# EAGLE design untitled (EAGLE 9.1.0)

## Sheet 1 of 2: voltage part
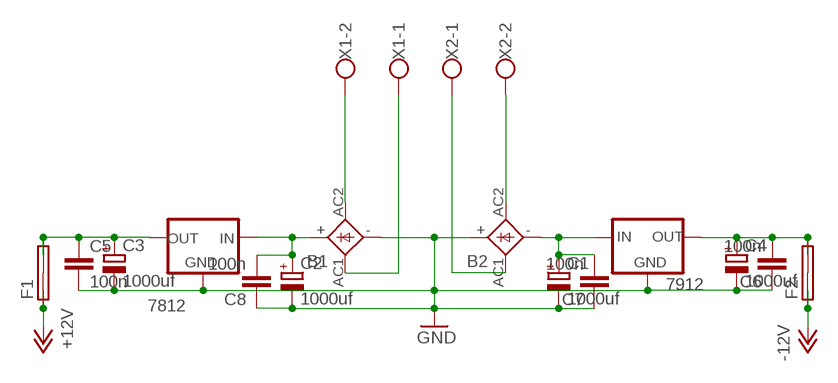
[diagram p0: schematic, sheet 1]

### Parts
7812  79XXS  [79XXS]
7912  78XXS  [78XXS]
B1  FB15  [FB15]
B2  FB15  [FB15]
C1  1000uf  CPOL-EUTT5D11  [TT5D11]
C2  1000uf  CPOL-EUTT5D11  [TT5D11]
C3  1000uf  CPOL-EUTT5D11  [TT5D11]
C4  1000uf  CPOL-EUTT5D11  [TT5D11]
C5  100n  C-EU075-032X103  [C075-032X103]
C6  100n  C-EU075-032X103  [C075-032X103]
C7  100n  C-EU075-032X103  [C075-032X103]
C8  100n  C-EU075-032X103  [C075-032X103]
F1  SHK20L  [SHK20L]
F2  SHK20L  [SHK20L]
X1  W237-102  [W237-102]
X2  W237-102  [W237-102]

### Nets
+12V: F1.1A F1.1B ; also sheet 2
-12V: F2.1A F2.1B ; also sheet 2
GND: 7812.GND 7912.GND B1.- B2.+ C1.- C2.- C3.- C4.- C5.2 C6.1 C7.1 C8.1 ; also sheet 2
N$1: 7912.IN B2.- C1.+ C7.2
N$3: 7812.IN B1.+ C2.+ C8.2
N$5: 7912.OUT C4.+ C6.2 F2.2A F2.2B
N$6: 7812.OUT C3.+ C5.1 F1.2A F1.2B
N$7: B1.AC2 X1.2
N$8: B2.AC2 X2.2
N$9: B1.AC1 X1.1
N$10: B2.AC1 X2.1

## Sheet 2 of 2: bus part
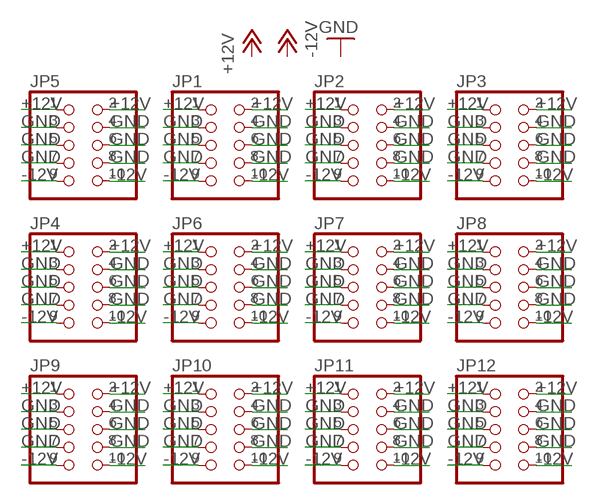
[diagram p1: schematic, sheet 2]

### Parts
JP1  PINHD-2X5  [2X05]
JP2  PINHD-2X5  [2X05]
JP3  PINHD-2X5  [2X05]
JP4  PINHD-2X5  [2X05]
JP5  PINHD-2X5  [2X05]
JP6  PINHD-2X5  [2X05]
JP7  PINHD-2X5  [2X05]
JP8  PINHD-2X5  [2X05]
JP9  PINHD-2X5  [2X05]
JP10  PINHD-2X5  [2X05]
JP11  PINHD-2X5  [2X05]
JP12  PINHD-2X5  [2X05]

### Nets
+12V: JP1.1 JP1.2 JP2.1 JP2.2 JP3.1 JP3.2 JP4.1 JP4.2 JP5.1 JP5.2 JP6.1 JP6.2 JP7.1 JP7.2 JP8.1 JP8.2 JP9.1 JP9.2 JP10.1 JP10.2 JP11.1 JP11.2 JP12.1 JP12.2 ; also sheet 1
-12V: JP1.9 JP1.10 JP2.9 JP2.10 JP3.9 JP3.10 JP4.9 JP4.10 JP5.9 JP5.10 JP6.9 JP6.10 JP7.9 JP7.10 JP8.9 JP8.10 JP9.9 JP9.10 JP10.9 JP10.10 JP11.9 JP11.10 JP12.9 JP12.10 ; also sheet 1
GND: JP1.3 JP1.4 JP1.5 JP1.6 JP1.7 JP1.8 JP2.3 JP2.4 JP2.5 JP2.6 JP2.7 JP2.8 JP3.3 JP3.4 JP3.5 JP3.6 JP3.7 JP3.8 JP4.3 JP4.4 JP4.5 JP4.6 JP4.7 JP4.8 JP5.3 JP5.4 JP5.5 JP5.6 JP5.7 JP5.8 JP6.3 JP6.4 JP6.5 JP6.6 JP6.7 JP6.8 JP7.3 JP7.4 JP7.5 JP7.6 JP7.7 JP7.8 JP8.3 JP8.4 JP8.5 JP8.6 JP8.7 JP8.8 JP9.3 JP9.4 JP9.5 JP9.6 JP9.7 JP9.8 JP10.3 JP10.4 JP10.5 JP10.6 JP10.7 JP10.8 JP11.3 JP11.4 JP11.5 JP11.6 JP11.7 JP11.8 JP12.3 JP12.4 JP12.5 JP12.6 JP12.7 JP12.8 ; also sheet 1

## Library data of the parts
7812 = v-reg:79XXS: VOLTAGE REGULATOR
7912 = v-reg:78XXS: VOLTAGE REGULATOR
B1 B2 = rectifier:FB15: FAGOR RECTIFIER grid 3 x 5 mm
C1-C4 = resistor:CPOL-EU: POLARIZED CAPACITOR, European symbol
C5-C8 = resistor:C-EU: CAPACITOR, European symbol
F1 F2 = fuse:SHK20L: FUSE HOLDER 5 x 20 mm, SH contact, SHH1 Schukat, E1073 Buerklin; OC_FARNELL: unknown; OC_NEWARK: unknown
JP1-JP12 = pinhead:PINHD-2X5: PIN HEADER
X1 X2 = con-wago-500:W237-102: WAGO SCREW CLAMP; MPN: 237-102; OC_FARNELL: unknown; OC_NEWARK: 70K9898

## Net classes
0 default: width 1.27 mm

## Board
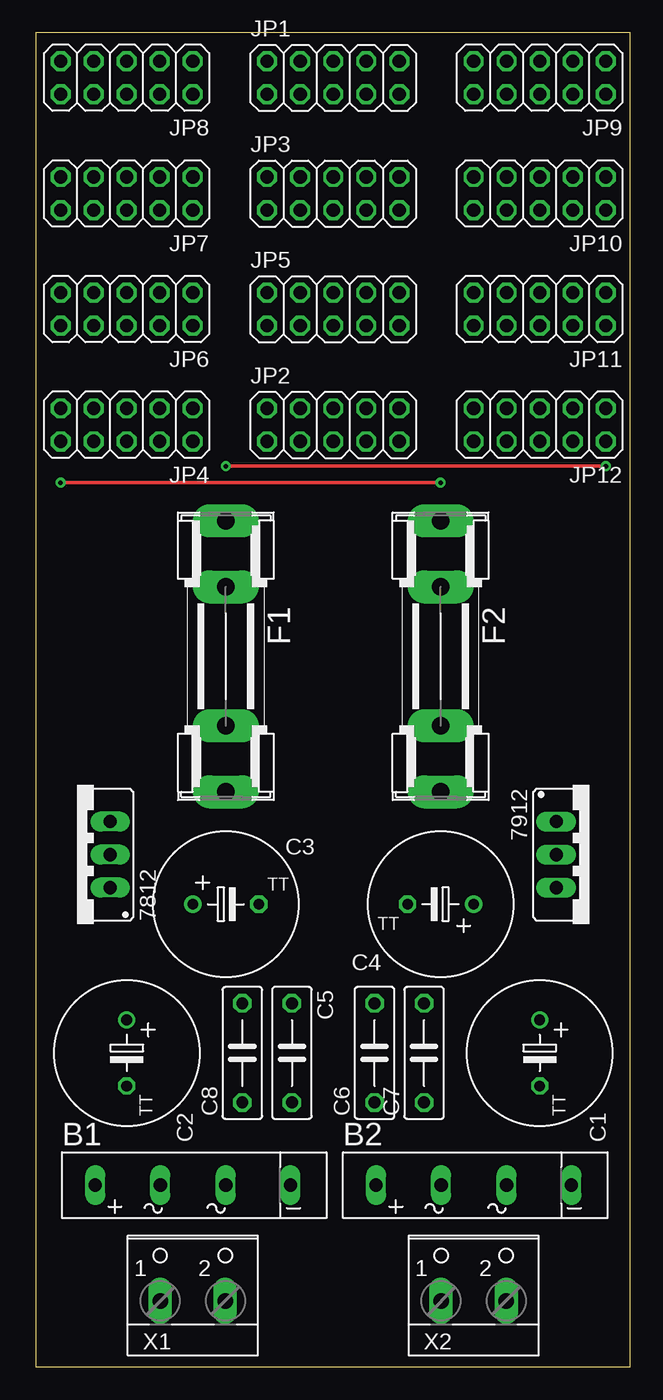
[diagram p2: board, top side]
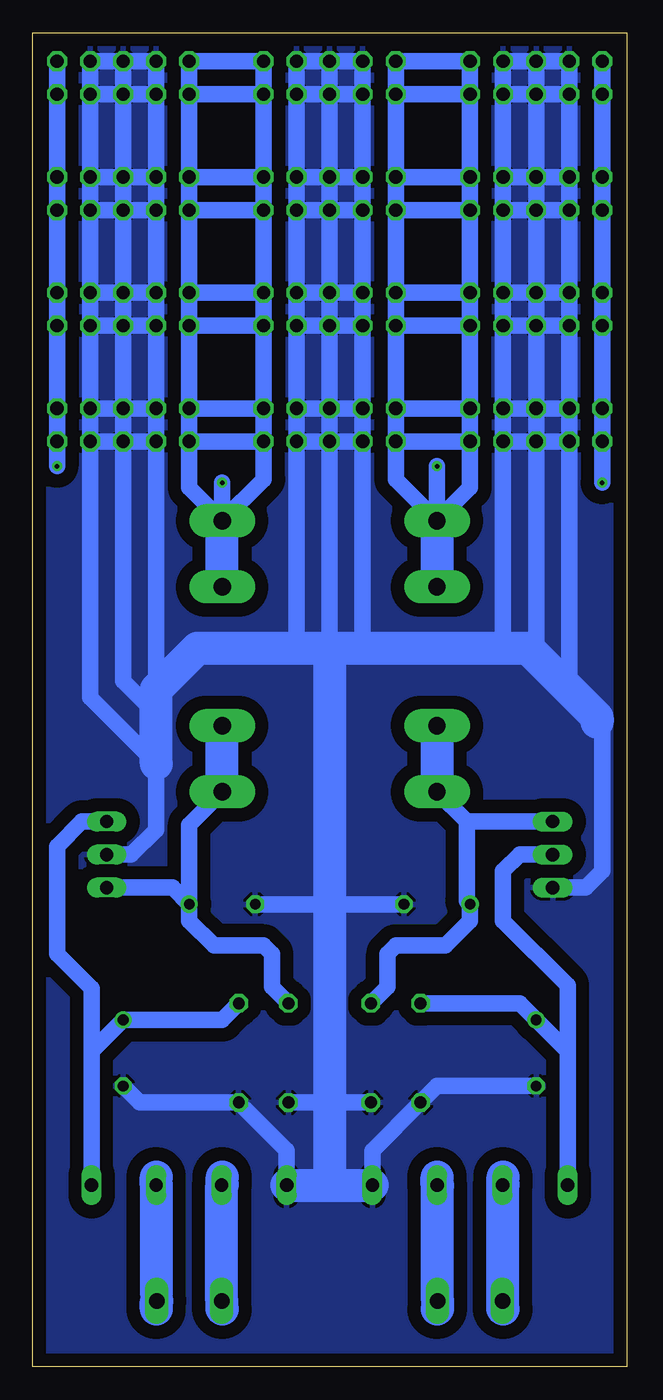
[diagram p3: board, bottom side, seen from below]

Size 45.7 x 102.54 mm. Coordinates in mm from the lower left corner, seen from the top.
Outline: 0,0 45.7,0 45.7,102.54 0,102.54 0,0
Copper layers (1*16): Top 0.035mm / dielectric 1.5mm / Bottom 0.035mm
Design rules "default": minimum track width 6mil, minimum drill 0.35mm, track to track 6mil, track to pad 6mil, pad to pad 6mil, via to via 6mil, smd to smd 6mil, copper to edge 40mil, drill to drill 6mil, minimum pad ring 10mil, minimum via ring 8mil, stop-mask expansion 4mil, vias tented up to drill 0mil, thermal gap 10mil

### Footprints (pad centres in the part's own frame; a part is rotated, then mirrored left to right if it is on the bottom)
79XXS = drill 1.016 long: GND -2.54,-2.54; IN 0,-2.54; OUT 2.54,-2.54
78XXS = drill 1.016 long: GND 0,-2.54; IN -2.54,-2.54; OUT 2.54,-2.54
FB15 = drill 1.016 long: + -7.5,0; - 7.511,0; AC1 -2.496,0; AC2 2.533,0
TT5D11 = drill 0.813: + -2.54,0 | drill 0.813 octagon: - 2.54,0
C075-032X103 = drill 0.914 octagon: 1 -3.81,0; 2 3.81,0
SHK20L = drill 1.321 pad 2.54 long: 1A -10.414,0; 1B -5.334,0; 2A 10.414,0; 2B 5.334,0
2X05 = drill 1.016 octagon: 1 -5.08,-1.27; 2 -5.08,1.27; 3 -2.54,-1.27; 4 -2.54,1.27; 5 0,-1.27; 6 0,1.27; 7 2.54,-1.27; 8 2.54,1.27; 9 5.08,-1.27; 10 5.08,1.27
W237-102 = drill 1.194 long: 1 -2.5,-1.27; 2 2.5,-1.27

### Placement (x,y rotation side)
7812  3.17,39.37 90 top
7912  42.55,39.37 270 top
B1  12.07,13.97 0 top
B2  33.66,13.97 0 top
C1  38.73,24.13 270 top
C2  6.98,24.13 270 top
C3  14.61,35.56 0 top
C4  31.12,35.56 180 top
C5  19.68,24.13 270 top
C6  26.04,24.13 90 top
C7  29.84,24.13 90 top
C8  15.88,24.13 90 top
F1  14.61,54.61 270 top
F2  31.12,54.61 270 top
JP1  22.86,99.06 0 top
JP2  22.86,72.39 0 top
JP3  22.86,90.17 0 top
JP4  6.98,72.39 180 top
JP5  22.86,81.28 0 top
JP6  6.98,81.28 180 top
JP7  6.98,90.17 180 top
JP8  6.98,99.06 180 top
JP9  38.73,99.06 180 top
JP10  38.73,90.17 180 top
JP11  38.73,81.28 180 top
JP12  38.73,72.39 180 top
X1  12.07,6.35 0 top
X2  33.66,6.35 0 top

### Tracks (layer width: path | path; a pad name or v marks a point on that pad's centre or on a via)
+12V  (via drill 0.35)
  Top 0.254: v43.81,69.22 v14.61,69.22
  Bottom 1.27: F1.1A 17.78,68.2 JP2.1 | JP2.1 JP2.2 | JP2.2 JP5.1 | JP5.1 JP5.2 | JP5.2 JP3.1 | JP3.1 JP3.2 | JP3.2 JP1.1 | JP1.1 JP1.2 JP8.1 JP8.2 | JP7.1 JP7.2 | JP6.1 JP6.2 JP5.1 | JP4.1 JP4.2 | JP2.1 JP4.2 | JP3.1 JP7.2 | JP1.1 JP8.2 | JP9.2 JP9.1 JP10.2 JP10.1 JP11.2 JP11.1 JP12.2 | JP12.2 JP12.1 | JP4.1 JP2.2 | JP4.1 JP6.1 | JP6.1 JP5.2 | JP6.1 JP7.2 | JP7.1 JP3.2 | JP7.1 JP8.2 | JP4.2 12.07,67.56 F1.1A | JP12.2 v43.81,69.22 | v14.61,69.22 F1.1A
  Bottom 2.54: F1.1A F1.1B
-12V  (via drill 0.35)
  Top 0.254: v1.9,67.94 v31.12,67.94
  Bottom 1.27: JP1.9 JP1.10 JP9.9 | JP1.9 JP3.10 | JP3.10 JP3.9 | JP3.9 JP5.10 | JP5.10 JP5.9 | JP5.9 JP2.10 | JP2.10 JP2.9 | F2.1A 27.94,68.2 JP2.9 | JP8.9 JP8.10 JP7.9 JP7.10 JP6.9 JP6.10 JP4.9 JP4.10 v1.9,67.94 | JP9.9 JP9.10 JP1.9 | JP11.9 JP12.9 | JP12.9 JP12.10 | JP11.9 JP11.10 JP5.9 | JP11.9 JP10.9 | JP10.9 JP10.10 JP3.9 | JP10.9 JP9.9 | JP12.10 33.66,67.56 F2.1A | JP12.10 JP2.9 | JP2.10 JP12.9 | JP5.10 JP11.9 | JP3.10 JP10.9 | v31.12,67.94 F2.1A
  Bottom 2.54: F2.1B F2.1A
GND
  Bottom 1.27: JP2.6 JP2.4 | JP2.4 JP2.3 | JP2.3 JP2.5 | JP2.5 JP2.6 | JP2.8 JP2.7 | JP2.7 JP2.5 | JP2.6 JP2.8 | JP2.8 JP5.7 | JP5.7 JP5.8 | JP5.8 JP3.7 | JP3.7 JP3.8 | JP3.8 JP1.7 | JP1.7 JP1.8 JP1.6 | JP1.6 JP1.5 | JP1.5 JP3.6 | JP3.6 JP3.5 | JP3.5 JP5.6 | JP5.6 JP5.5 | JP5.5 JP2.6 | JP2.4 JP5.3 | JP5.3 JP5.4 | JP5.4 JP3.3 | JP3.3 JP3.4 | JP3.4 JP1.3 | JP1.3 JP1.4 JP1.6 | JP1.7 JP1.5 | JP1.5 JP1.3 | JP3.4 JP3.6 | JP3.6 JP3.8 | JP3.7 JP3.5 | JP3.5 JP3.3 | JP5.4 JP5.6 | JP5.6 JP5.8 | JP5.7 JP5.5 | JP5.5 JP5.3 | 22.86,13.97 B1.- 19.58,16.62 C8.1 14.61,21.59 C2.- | 22.86,13.97 B2.+ 26.16,16.63 C7.1 37.46,20.32 C1.- | 22.86,13.97 22.86,20.32 | 22.86,20.32 22.86,35.56 | 22.86,55.24 JP2.5 | 7812.GND 3.17,36.83 1.9,38.1 1.9,49.53 4.45,52.07 | 4.45,52.07 6.98,54.61 | 6.98,54.61 7.62,55.24 9.53,55.24 | 9.53,55.24 20.32,55.24 | 20.32,55.24 22.86,55.24 | 22.86,55.24 25.4,55.24 | 25.4,55.24 33.02,55.24 | 36.2,50.16 36.2,52.07 JP12.8 | 36.2,50.16 36.2,46.35 | 36.2,46.35 36.2,41.27 38.1,39.37 7912.GND | C5.2 22.86,20.32 | C6.1 22.86,20.32 | JP4.7 JP4.8 | JP4.8 JP4.6 | JP4.7 JP4.5 | JP4.6 JP4.4 | JP4.5 JP4.3 | JP6.7 JP6.8 | JP6.8 JP6.6 | JP6.7 JP6.5 | JP6.6 JP6.4 | JP6.5 JP6.3 | JP6.4 JP4.3 | JP7.7 JP7.8 | JP7.8 JP7.6 | JP7.7 JP7.5 | JP7.6 JP7.4 | JP7.5 JP7.3 | JP8.8 JP8.7 JP8.5 | JP8.8 JP8.6 | JP8.6 JP8.4 | JP8.5 JP8.3 JP8.4 | JP8.4 JP7.3 | JP7.4 JP6.3 | 9.53,55.24 JP4.4 | JP9.4 JP9.3 JP9.5 | JP9.4 JP9.6 | JP9.5 JP9.7 JP10.8 JP10.6 | JP9.6 JP9.8 | JP10.4 JP10.3 | JP10.3 JP10.5 | JP10.4 JP10.6 | JP10.5 JP10.7 JP11.8 JP11.6 | JP12.4 JP12.3 | JP12.3 JP12.5 | JP12.4 JP12.6 | JP12.5 JP12.7 | JP12.6 JP12.8 | JP11.4 JP11.3 | JP11.3 JP11.5 | JP11.4 JP11.6 | JP11.5 JP11.7 JP12.8 | JP8.5 JP8.6 | JP7.5 JP7.6 | JP7.4 JP7.3 | JP7.5 JP8.6 | JP8.8 JP7.7 | JP7.6 JP6.5 | JP7.8 JP6.7 | JP6.6 JP4.5 | JP6.8 JP4.7 | JP4.6 JP4.5
  Bottom 1.27: JP4.4 JP4.3 | JP6.4 JP6.3 | JP6.5 JP6.6 | JP4.8 4.45,52.07 | JP4.6 6.98,54.61 | JP2.3 20.32,55.24 | JP2.7 25.4,55.24 | JP12.3 JP11.4 | JP11.6 JP12.5 | JP11.5 JP10.6 | JP10.4 JP11.3 | JP10.3 JP9.4 | JP9.6 JP10.5 | JP10.5 JP10.6 | JP9.6 JP9.5 | JP11.5 JP11.6 | JP12.5 JP12.6 | JP12.6 38.73,52.7 36.2,50.16 | JP12.4 41.27,51.44 36.2,46.35 | C3.- 22.86,35.56 | 22.86,35.56 C4.-
  Bottom 2.54: 22.86,55.24 22.86,35.56 22.86,13.97 | B2.+ B1.- | 36.2,46.35 36.2,52.07 33.02,55.24 22.86,55.24 | 22.86,55.24 7.62,55.24 2.29,49.91 2.29,49.53
  pour Bottom (isolate 1.016): 0,102.87 45.72,102.87 45.72,0 0,0 0,102.23
N$1
  Bottom 1.27: B2.- 41.17,24.24 | 41.17,24.24 C1.+ 31.12,26.67 C7.2 | 41.17,24.24 41.17,29.1 43.81,31.75 43.81,40.01 41.91,41.91 7912.IN
N$3
  Bottom 1.27: 7812.IN 8.25,39.37 9.53,38.1 9.53,34.29 4.56,29.33 4.56,24.25 | 4.56,24.25 C2.+ 8.25,27.94 C8.2 | B1.+ 4.56,24.25
N$5
  Bottom 1.27: C4.+ 33.66,41.66 F2.2A | 7912.OUT 34.92,36.83 C4.+ | C6.2 27.3,29.21 27.3,31.75 27.94,32.38 31.75,32.38 33.66,34.29 C4.+
  Bottom 2.54: F2.2A F2.2B
N$6
  Bottom 1.27: 7812.OUT 12.32,41.91 | 12.32,41.91 F1.2A | 12.32,41.91 12.32,35.81 C3.+ 12.07,34.29 13.97,32.38 17.78,32.38 18.41,31.75 18.41,29.21 C5.1
  Bottom 2.54: F1.2B F1.2A
N$7
  Bottom 1.27: 14.57,13.94 B1.AC2
  Bottom 2.54: 14.57,13.94 X1.2 14.57,4.49 14.61,4.45 | B1.AC2 14.6,14.6 14.61,14.61
N$8
  Bottom 1.27: 36.19,5.71 36.19,5.11 X2.2
  Bottom 2.54: 36.19,5.71 B2.AC2 36.19,14.6 36.2,14.61 | 36.2,4.45 36.2,5.04 X2.2
N$9
  Bottom 1.27: X1.1
  Bottom 2.54: X1.1 B1.AC1 9.53,14.01 9.53,14.61 | X1.1 9.56,4.49 9.53,4.45
N$10
  Bottom 1.27: B2.AC1
  Bottom 2.54: B2.AC1 X2.1 31.16,4.49 31.12,4.45 | B2.AC1 31.12,14.01 31.12,14.61